# EAGLE design Enclosure 100x68 BPS (EAGLE 9.6.2)
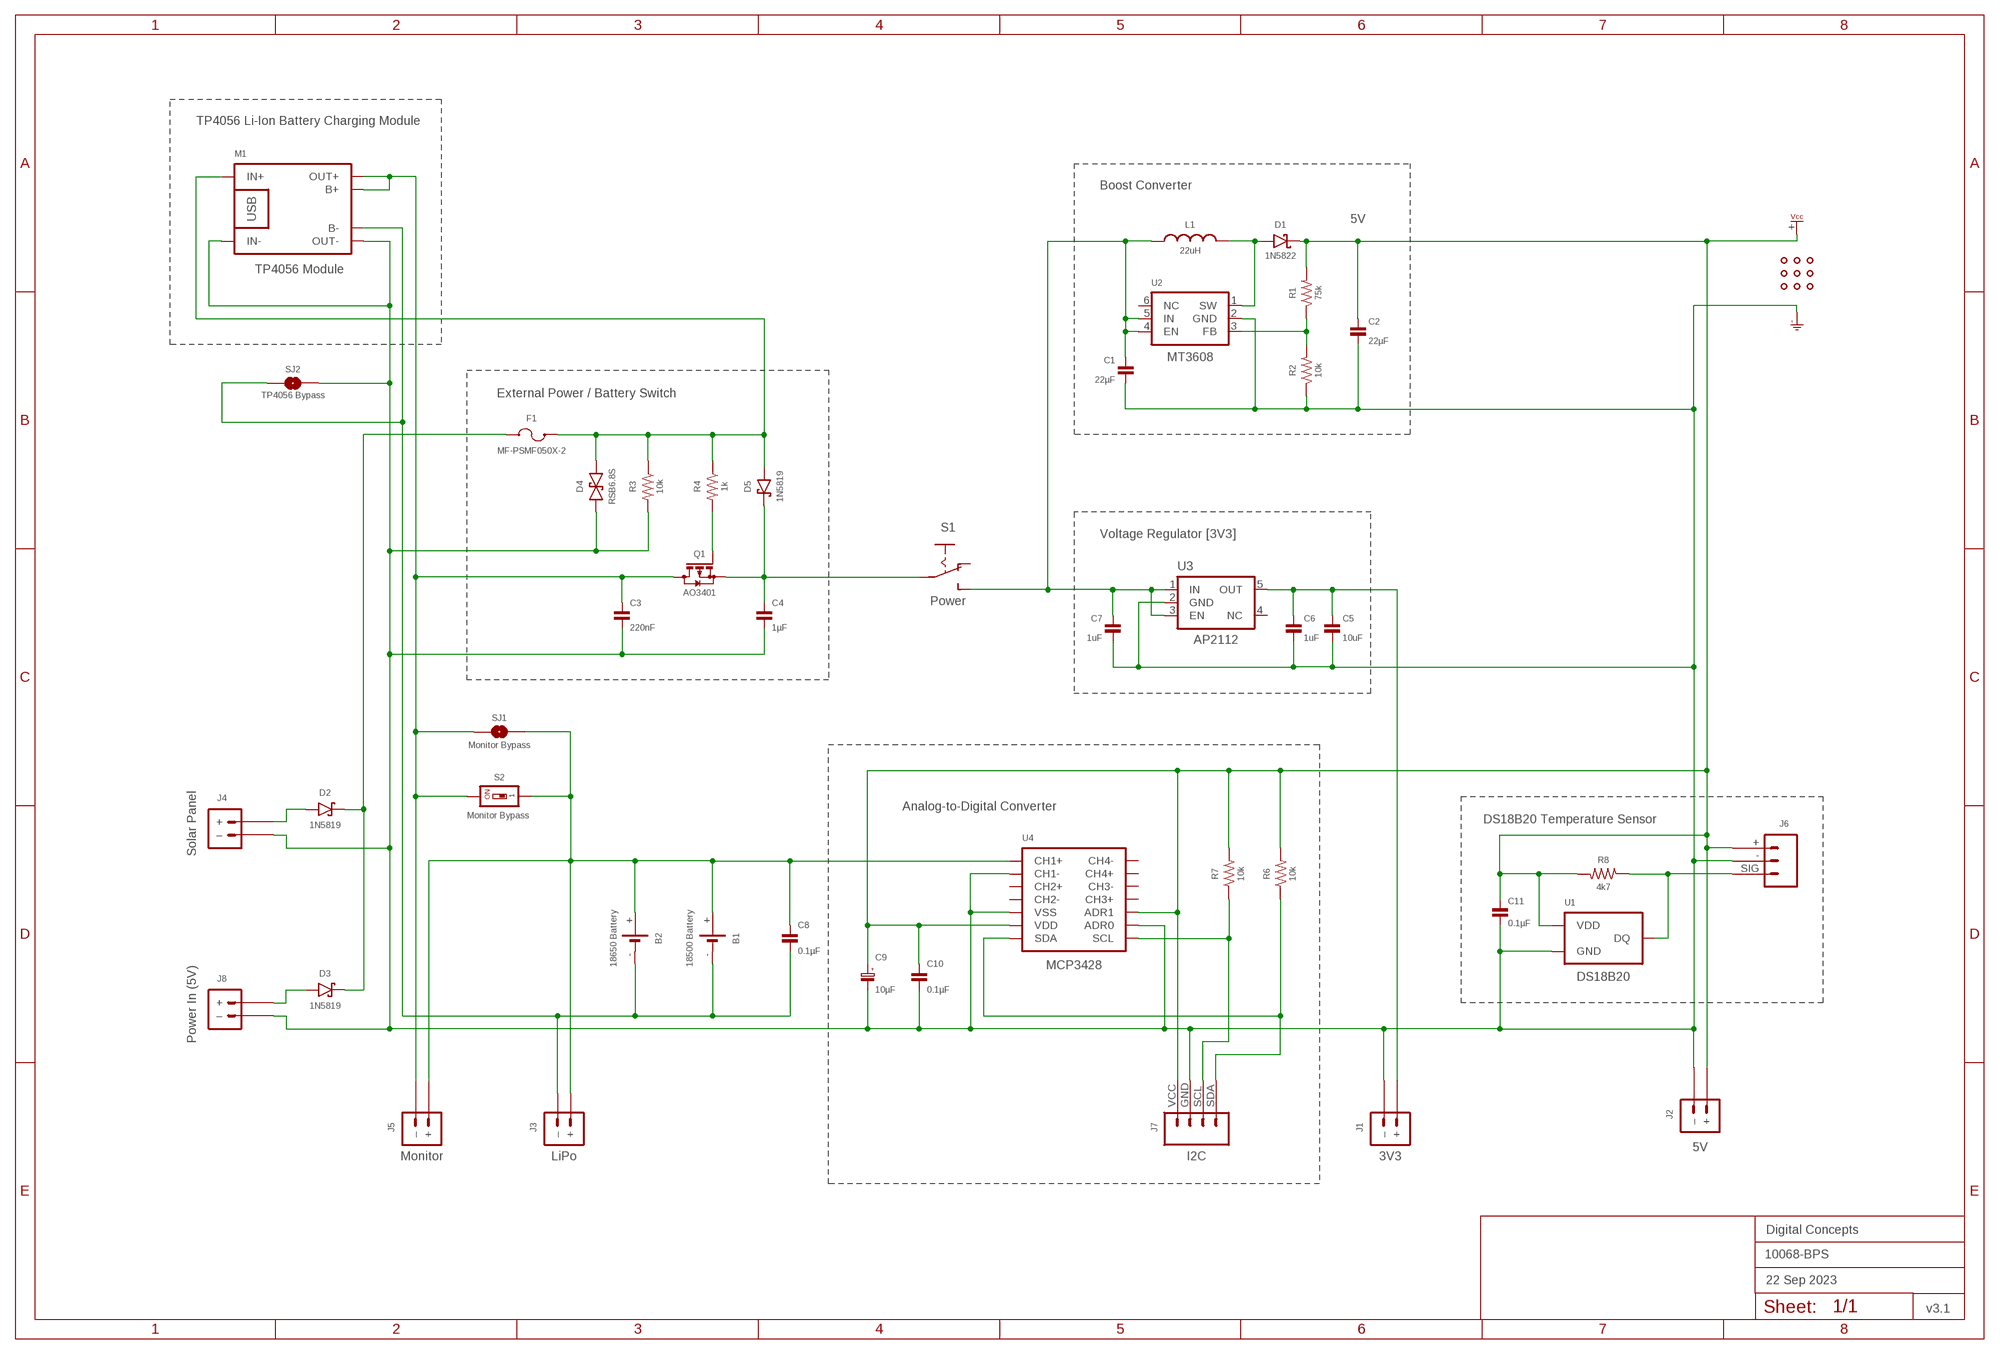
[diagram p0: schematic, sheet 1]
FRAME2 (A3L-LOC): DATE: 22 Sep 2023; OWNER: Digital Concepts; TITLE: 10068-BPS; VERSION: v3.1

## Parts
B1  18500 Battery  BATTERY-HOLDER-18500  [BATTERY-18500]
B2  18650 Battery  BATTERY-HOLDER-18650  [BATTERY-18650]
C1  22µF  CAPACITOR-1206  [C1206]
C2  22µF  CAPACITOR-1206  [C1206]
C3  220nF  CAPACITOR-0805  [C0805]
C4  1µF  CAPACITOR-0805  [C0805]
C5  10uF  CAPACITOR-0805  [C0805]
C6  1uF  CAPACITOR-0805  [C0805]
C7  1uF  CAPACITOR-0805  [C0805]
C8  0.1µF  CAPACITOR-0805  [C0805]
C9  10µF  CAPACITOR-1206-TANTALUM  [C1206-POLARISED]
C10  0.1µF  CAPACITOR-0805  [C0805]
C11  0.1µF  CAPACITOR-0805  [C0805]
D1  1N5822  DIODE-SCHOTTKY-1N5822  [DIODE_SMB]
D2  1N5819  DIODE-SCHOTTKY-1N5819  [SOD-123]
D3  1N5819  DIODE-SCHOTTKY-1N5819  [SOD-123]
D4  RSB6.8S  DIODE-BIDIRECTIONAL-RSB6.8S  [EMD2]
D5  1N5819  DIODE-SCHOTTKY-1N5819  [SOD-123]
F1  MF-PSMF050X-2  [F0805]
J1  3V3  JST-PH2.0-2-VERTICAL-POWER  [JST-PH2.0-2-VERTICAL-POWER]
J2  5V  JST-PH2.0-2-VERTICAL-POWER  [JST-PH2.0-2-VERTICAL-POWER]
J3  LiPo  JST-PH2.0-2-HORIZONTAL-POWERJST-PTH-2  [JST-PH2.0-2-HORIZONTAL-POWER]
J4  Solar Panel  JST-PH2.0-2-VERTICAL-POWER  [JST-PH2.0-2-VERTICAL-POWER]
J5  Monitor  JST-PH2.0-2-VERTICAL-POWER  [JST-PH2.0-2-VERTICAL-POWER]
J6  JST-PH2.0-3-HORIZONTAL-DS18B20  [JST-PH2.0-3-HORIZONTAL-DS18B20]
J7  I2C  JST-PH2.0-4-HORIZONTAL-I2C  [JST-PH2.0-4-HORIZONTAL-I2C]
J8  Power In (5V)  JST-GH1.25-2-HORIZONTAL-POWER  [JST-GH1.25-2-HORIZONTAL]
L1  22uH  INDUCTOR-CDRH104R+L5038P  [CDRH104R+]
M1  TP4056 Module  BATTERY-CHARGER-LI-PROT  [BATTERY-CHARGER-LI-PROT]
Q1  AO3401  MOSFET-AO3401  [SOT-23]
R1  75k  RESISTORR0805  [R0805]
R2  10k  RESISTORR0805  [R0805]
R3  10k  RESISTORR0805  [R0805]
R4  1k  RESISTORR0805  [R0805]
R6  10k  RESISTORR0805  [R0805]
R7  10k  RESISTORR0805  [R0805]
R8  4k7  RESISTORR0805  [R0805]
S1  Power  SWITCH-SLIDE-SPDT-PTH  [SWITCH-SPDT-PTH]
S2  Monitor Bypass  SWITCH-DIP-SWS001-VIA-1  [SMD-001-VIA-1]
SJ1  Monitor Bypass  SJ  [SJ]
SJ2  TP4056 Bypass  SJ  [SJ]
U1  DS18B20  THERMOMETER-DS18B20  [TO-92]
U2  MT3608  [SOT-23-6]
U3  AP2112  REGULATOR-AP2112  [SOT25]
U4  MCP3428  [SOIC-14]
U$1  PROTO-34X22-PI-CUT  [PROTO-34X22-PI-CUT]

## Nets
3V3: C5.1 C6.1 J1.+ U3.5(OUT)
5V: C2.1 C9.1(+) C10.1 C11.1 D1.C J2.+ J6.+ J7.VCC R1.2 R6.2 R7.2 R8.2 U1.3(VDD) U4.P$6(VDD) U4.P$10(ADR1) U$1.+(VCC)
GND: C1.2 C2.2 C3.2 C4.2 C5.2 C6.2 C7.2 C9.2(-) C10.2 C11.2 D4.P$2 J1.-(–) J2.-(–) J4.-(–) J6.- J7.GND J8.-(–) M1.IN- M1.OUT- R2.1 R3.2 SJ2.1 U1.1(GND) U2.2(GND) U3.2(GND) U4.P$2(CH1-) U4.P$5(VSS) U4.P$9(ADR0) U$1.-(GND)
N$1: D2.A J4.+
N$2: C1.1 C7.1 L1.2 S1.3(S) U2.4(EN) U2.5(IN) U3.1(IN) U3.3(EN)
N$4: R1.1 R2.2 U2.3(FB)
N$5: J7.SCL R7.1 U4.P$8(SCL)
N$6: D1.A L1.1 U2.1(SW)
N$7: D4.P$1 D5.A F1.2 M1.IN+ R3.1 R4.1
N$8: C4.1 D5.C Q1.2(S) S1.2(P)
N$10: B1.+ B2.+ C8.1 J3.+ J5.+ S2.1 S2.1@VIA SJ1.1 U4.P$1(CH1+)
N$11: D3.A J8.+
N$13: J6.SIG R8.1 U1.2(DQ)
N$15: J7.SDA R6.1 U4.P$7(SDA)
N$16: Q1.1(G) R4.2
N$17: C3.1 J5.-(–) M1.B+ M1.OUT+ Q1.3(D) S2.2 SJ1.2
N$38: B1.- B2.- C8.2 J3.-(–) M1.B- SJ2.2
N$41: D2.C D3.C F1.1
Unconnected: S1.1(O) U2.6(NC) U3.4(NC) U4.P$3(CH2+) U4.P$4(CH2-) U4.P$11(CH3+) U4.P$12(CH3-) U4.P$13(CH4+) U4.P$14(CH4-)

## Notes on the sheet
- TP4056 Li-Ion Battery Charging Module
- Boost Converter
- 5V
- External Power / Battery Switch
- Voltage Regulator [3V3]
- Analog-to-Digital Converter
- DS18B20 Temperature Sensor

## Library data of the parts
B1 = digitalconcepts:BATTERY-HOLDER-18500: 18500 Battery Holder
B2 = digitalconcepts:BATTERY-HOLDER-18650: 18650 Battery Holder
C1 C2 = digitalconcepts:CAPACITOR-1206: 1206 Capacitor
C3-C8 C10 C11 = digitalconcepts:CAPACITOR-0805: 0805 Capacitor
C9 = digitalconcepts:CAPACITOR-1206-TANTALUM: Capacitor 1206 Tantalum
D1 = digitalconcepts:DIODE-SCHOTTKY-1N5822: 1N5822 Schottky Diode SMB
D2 D3 D5 = digitalconcepts:DIODE-SCHOTTKY-1N5819: 1N5819 Schottky Diode SOD-123
D4 = digitalconcepts:DIODE-BIDIRECTIONAL-RSB6.8S: Schottky Bidirectional Diode
F1 = digitalconcepts:MF-PSMF050X-2: PTC Resettable Fuse 0.5A/6V 500mA SMD
J1 J2 J4 J5 = digitalconcepts:JST-PH2.0-2-VERTICAL-POWER: JST PH2.0 2P PTH Connector (Power)
J3 = digitalconcepts:JST-PH2.0-2-HORIZONTAL-POWER: PH2.0 2P Right Angle PCB Connector; PROD_ID: CONN-09863; SKU: PRT-09914
J6 = digitalconcepts:JST-PH2.0-3-HORIZONTAL-DS18B20: DS18B20 PH2.0 Right Angle PCB Connector
J7 = digitalconcepts:JST-PH2.0-4-HORIZONTAL-I2C: PH2.0 4P Horizontal I2C
J8 = digitalconcepts:JST-GH1.25-2-HORIZONTAL-POWER: JST GH1.25 2P PTH Connector (Power)
L1 = digitalconcepts:INDUCTOR-CDRH104R+: Inductor SMD CDRH104R, with extended pads (for easier hand soldering); SPICEPREFIX: L
M1 = digitalconcepts:BATTERY-CHARGER-LI-PROT: TP4056 Li Battery Charger module with PCB (rather than module) footprint
Q1 = digitalconcepts:MOSFET-AO3401: AO3401 P-Channel MOSFET
R1-R4 R6-R8 = digitalconcepts:RESISTOR: Resistor; SPICEPREFIX: R
S1 = digitalconcepts:SWITCH-SLIDE-SPDT-PTH: Mini Sliding Switch SPDT PTH
S2 = digitalconcepts:SWITCH-DIP-SWS001-VIA-1: SMD Dip Switch 1 pol.
SJ1 SJ2 = digitalconcepts:SJ: Solder Jumper
U1 = digitalconcepts:THERMOMETER-DS18B20: Digital Thermometer -55C-125C TO92-3; AVAILABILITY: Bad; DESCRIPTION: Temperature Sensor Digital, Local -55°C ~ 125°C 12 b 8-uMAX; MF: Maxim Integrated; MP: DS18B20; PACKAGE: TO-92 Maxim Integrated; PRICE: None
U2 = digitalconcepts:MT3608: MT3608 DC-DC Step-Up Voltage Converter
U3 = digitalconcepts:REGULATOR-AP2112: Diodes Incorporated LDO Regulator with Enable; OC_FARNELL: unknown; OC_NEWARK: unknown
U4 = digitalconcepts:MCP3428: MCP3428 4 Channel ADC
U$1 = digitalconcepts:PROTO-34X22-PI-CUT: 34 x 22 Prototyping board, with Raspberyr Pi Zero mount points and power supply socket cut-out, to fit an 100 x 68 enclosure

## Board
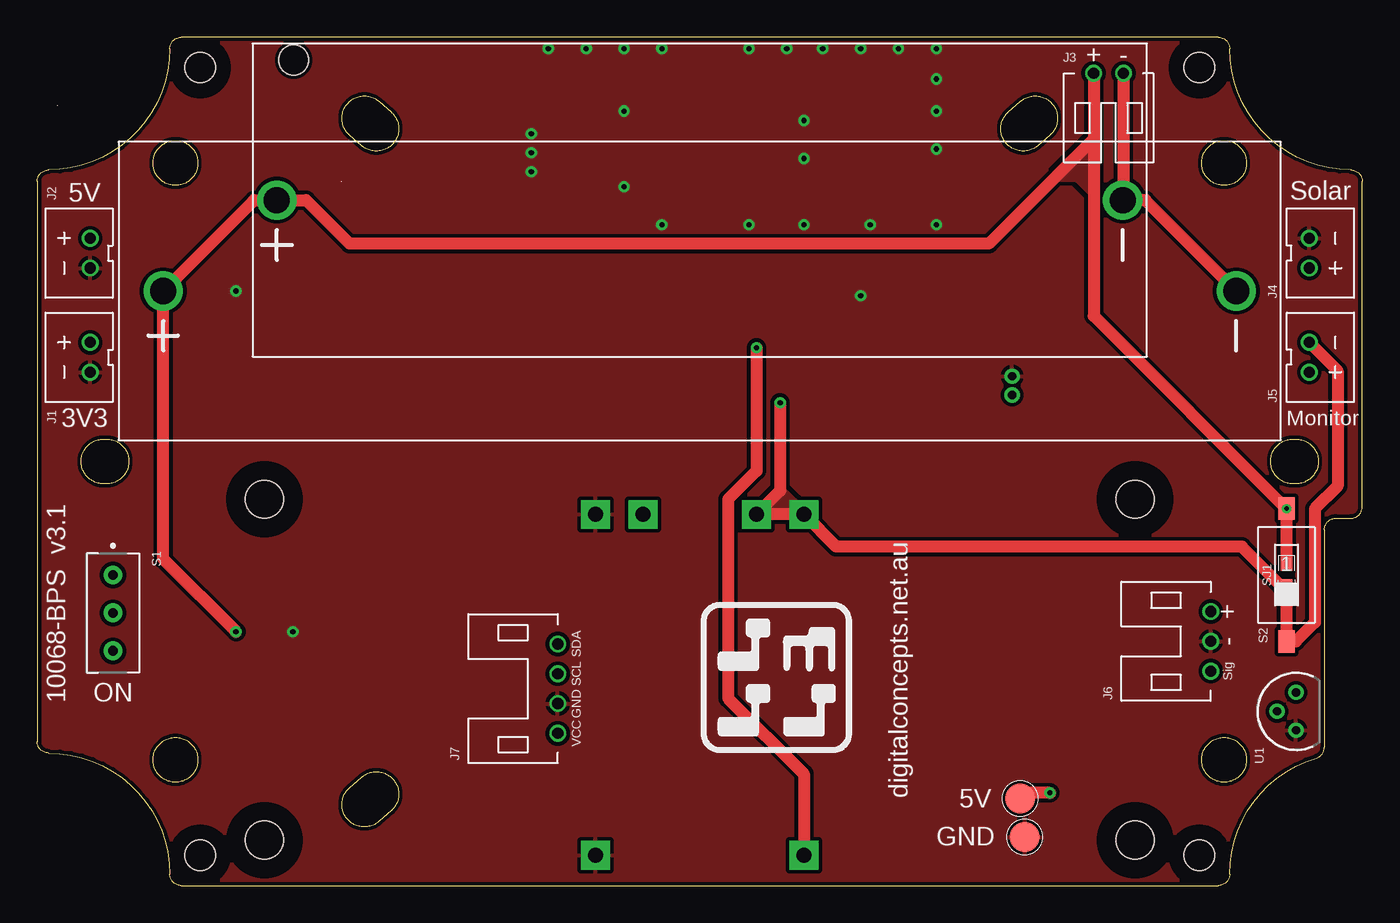
[diagram p1: board, top side]
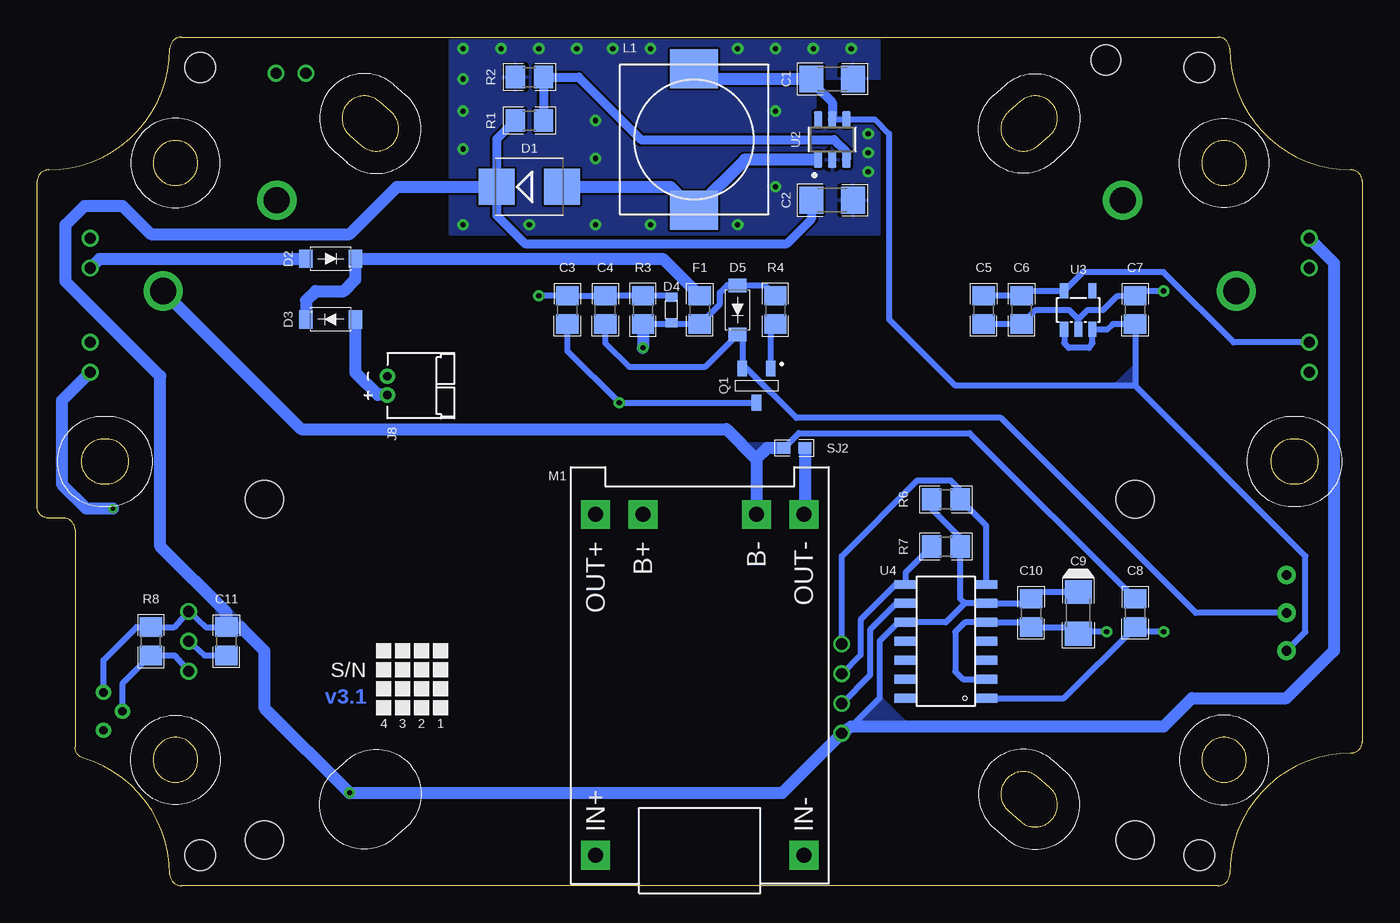
[diagram p2: board, bottom side, seen from below]

Size 88.9 x 56.9 mm. Coordinates in mm from the lower left corner, seen from the top.
Copper layers (1*16): Top 0.035mm / dielectric 1.5mm / Bottom 0.035mm
Design rules "default *": minimum track width 6mil, minimum drill 0.3mm, track to track 6mil, track to pad 6mil, pad to pad 6mil, via to via 6mil, smd to smd 6mil, copper to edge 6mil, drill to drill 6mil, minimum pad ring 1mil, minimum via ring 8mil, stop-mask expansion 4mil, vias tented up to drill 0mil, thermal gap 10mil

### Footprints (pad centres in the part's own frame; a part is rotated, then mirrored left to right if it is on the bottom)
BATTERY-18500 = drill 1.75: + -28.375,0; - 28.375,0 | hole 2: -27.25,9.4
BATTERY-18650 = drill 1.75: + -36,0; - 36,0
C1206 = smd 1.6 x 1.8: 1 -1.4,0; 2 1.4,0
C0805 = smd 1.3 x 1.5: 1 -0.95,0; 2 0.95,0
C1206-POLARISED = smd 1.6 x 1.8: 1 -1.4,0; 2 1.4,0
DIODE_SMB = smd 2.4 x 2.4: A 2.2,0; C -2.2,0
SOD-123 = smd 0.91 x 1.22: A -1.65,0; C 1.65,0
EMD2 = smd 0.6 x 0.8: P$1 -0.85,0; P$2 0.85,0
F0805 = smd 1.3 x 1.5: 1 -0.95,0; 2 0.95,0
JST-PH2.0-2-VERTICAL-POWER = drill 0.75: + -1,0; - 1,0
JST-PH2.0-2-HORIZONTAL-POWER = drill 0.75: + 1,0; - -1,0
JST-PH2.0-3-HORIZONTAL-DS18B20 = drill 0.75: + 2,0; - 0,0; SIG -2,0
JST-PH2.0-4-HORIZONTAL-I2C = drill 0.75: GND -1,0; SCL 1,0; SDA 3,0; VCC -3,0
JST-GH1.25-2-HORIZONTAL = drill 0.55 pad 1.016: + -0.625,0; - 0.625,0
CDRH104R+ = smd 2.6 x 3.2: 1 -4.75,0; 2 4.75,0
BATTERY-CHARGER-LI-PROT = drill 1 pad 1.93 square: B+ 10.795,3.81; B- 10.795,-3.81; IN+ -12.065,6.985; IN- -12.065,-6.985; OUT+ 10.795,6.985; OUT- 10.795,-6.985
SOT-23 = smd 0.65 x 1.05: 1 -0.95,-1.15; 2 0.95,-1.15; 3 0,1.15
R0805 = smd 1.3 x 1.5: 1 -0.95,0; 2 0.95,0
SWITCH-SPDT-PTH = drill 0.65 pad 1.27: 1 -2.54,0; 2 0,0; 3 2.54,0
SMD-001-VIA-1 = smd 1.1 x 1.5: 1 0,-4.45; 2 0,4.45 | drill 0.3 pad 0.61: 1@VIA 0,-4.45
SJ = smd 0.864 x 0.762: 1 -0.711,0; 2 0.711,0
TO-92 = drill 0.55 pad 1.016: 1 -1.27,0; 2 0,1.27; 3 1.27,0
SOT-23-6 = smd 1.1 x 0.6: 1 -1.35,0.95; 2 -1.35,0; 3 -1.35,-0.95; 4 1.35,-0.95; 5 1.35,0; 6 1.35,0.95
SOT25 = smd 0.55 x 1: 1 -0.95,-1.3; 2 0,-1.3; 3 0.95,-1.3; 4 0.95,1.3; 5 -0.95,1.3
SOIC-14 = smd 0.6 x 1.5: P$1 -3.815,-2.7; P$2 -2.54,-2.7; P$3 -1.27,-2.7; P$4 0,-2.7; P$5 1.27,-2.7; P$6 2.54,-2.7; P$7 3.81,-2.7; P$8 3.81,2.7; P$9 2.54,2.7; P$10 1.27,2.7; P$11 0,2.7; P$12 -1.27,2.7; P$13 -2.54,2.7; P$14 -3.81,2.7
PROTO-34X22-PI-CUT = smd 2 x 2: + 21.51,-22.6; - 21.81,-25.2 | hole 2.032: -33.528,26.416; 33.528,26.416; 33.528,-26.416; -33.528,-26.416 | hole 2.54: -29.21,-25.4; 29.21,-25.4; -29.21,-2.54; 29.21,-2.54

### Placement (x,y rotation side)
B1  44.45,45.97 0 top
B2  44.45,39.88 0 top
C1  35.56,54.1 0 bottom
C2  35.56,45.97 0 bottom
C3  53.34,38.61 90 bottom
C4  50.8,38.61 90 bottom
C5  25.4,38.61 270 bottom
C6  22.86,38.61 270 bottom
C7  15.24,38.61 90 bottom
C8  15.24,18.29 90 bottom
C9  19.05,18.29 270 bottom
C10  22.23,18.29 270 bottom
C11  76.2,16.38 270 bottom
D1  55.88,46.86 0 bottom
D2  69.22,42.04 0 bottom
D3  69.22,37.97 180 bottom
D4  46.36,38.61 90 bottom
D5  41.91,38.61 270 bottom
F1  44.45,38.61 270 bottom
J1  3.56,35.43 270 top
J2  3.56,42.42 270 top
J3  71.88,54.48 180 top
J4  85.34,42.42 90 top
J5  85.34,35.43 90 top
J6  78.74,16.38 90 top
J7  34.93,13.21 90 top
J8  65.41,33.53 90 bottom
L1  44.83,50.04 90 bottom
M1  44.45,14.1 90 bottom
Q1  40.64,33.53 180 bottom
R1  55.88,51.31 180 bottom
R2  55.88,54.23 0 bottom
R3  48.26,38.61 90 bottom
R4  39.37,38.61 270 bottom
R6  27.94,25.91 180 bottom
R7  27.94,22.73 0 bottom
R8  81.28,16.38 90 bottom
S1  5.08,18.29 270 top
S2  83.82,20.83 180 top
SJ1  83.82,20.83 270 top
SJ2  38.1,29.34 180 bottom
U1  84.45,11.68 90 top
U2  35.56,50.04 90 bottom
U3  19.05,38.61 0 bottom
U4  27.94,16.38 90 bottom
U$1  44.45,28.45 0 top

### Tracks (layer width: path | path; a pad name or v marks a point on that pad's centre or on a via)
3V3
  Bottom 0.406: C5.1 C6.1 22.51,39.91 U3.5 18.76,41.15 13.34,41.15 8.62,36.43 J1.+
5V  (via drill 0.35)
  Top 0.813: U$1.+ 66.34,6.22 v67.95,6.22
  Bottom 0.406: U1.3 84.45,15.11 82.23,17.33 R8.2 79.7,17.33 J6.+ 77.59,17.33 C11.1 | C9.1 21.78,19.69 C10.1 22.54,18.92 U4.P$6 26.67,18.92 | 26.67,18.92 27.94,17.65 U4.P$10 31.12,17.65 32.39,16.38 32.39,12.57 34.29,10.67 | R6.2 28.89,25.27 26.99,23.37 R7.2 26.99,19.24 26.67,18.92
  Bottom 0.61: C2.1 36.96,44.7 38.61,43.05 56.18,43.05 58.08,44.96 D1.C 58.08,50.06 R1.2
  Bottom 0.813: J2.+ 1.91,41.77 1.91,15.75 5.08,12.57 11.43,12.57 13.34,10.67 34.29,10.67 J7.VCC 38.91,6.22 v67.95,6.22 73.66,11.94 73.66,15.75 75.25,17.33 C11.1 76.2,18.29 80.64,22.73 80.64,34.16 87,40.51 87,44.32 85.73,45.59 83.19,45.59 81.28,43.69 67.95,43.69 64.77,46.86 D1.C
  pour Bottom (no thermals): 32.39,12.57 30.48,10.67 34.29,10.67
  pour Bottom (no thermals): 76.54,18.63 75.01,17.09 76.54,17.09
$X0
  cutout Bottom: 10.92,56.9 arc180 10.92,52.83 arc180
$X1
  cutout Bottom: 77.98,56.9 arc180 77.98,52.83 arc180
$X2
  cutout Bottom: 77.98,4.06 arc180 77.98,0 arc180
$X3
  cutout Bottom: 10.92,4.06 arc180 10.92,0 arc180
$X4
  cutout Top: 10.92,56.9 arc180 10.92,52.83 arc180
$X5
  cutout Top: 77.98,56.9 arc180 77.98,52.83 arc180
$X6
  cutout Top: 77.98,4.06 arc180 77.98,0 arc180
$X7
  cutout Top: 10.92,4.06 arc180 10.92,0 arc180
GND  (via drill 0.35)
  Bottom 0.406: D4.P$2 46.45,39.56 R3.2 C4.2 C3.2 v55.25,39.56 | C5.2 C6.2 21.91,38.61 19.69,38.61 19.05,37.97 | 19.05,37.97 18.42,38.61 17.38,38.61 16.43,39.56 C7.2 14.92,39.88 v13.34,39.88 | U3.2 19.05,37.97 | U4.P$2 26.79,13.84 27.3,14.36 27.3,17.02 26.67,17.65 U4.P$5 22.54,17.65 C10.2 19.5,17.34 19.12,16.95 | 19.12,16.95 C9.2 | U4.P$9 31.24,18.92 33.02,17.15 33.02,14.11 J7.GND | v17.15,17.02 19.05,17.02 19.12,16.95 | J6.- 77.7,15.43 C11.2
  Bottom 0.813: SJ2.1 37.39,24.97 M1.OUT-
  other vias: 33.15,50.42 33.15,49.15 33.15,47.88 39.37,51.94 47.75,44.32 39.37,56.13 51.44,48.77 41.91,56.13 50.29,56.13 39.37,46.86 41.91,44.32 47.75,56.13 52.7,56.13 55.25,56.13 57.79,56.13 36.83,56.13 34.29,56.13 60.33,56.13 51.44,51.31 60.33,54.1 60.33,49.4 60.33,51.94 51.44,44.32 60.33,44.32 55.88,44.32
  pour Top (isolate 0.254, rank 5): -2.97,59.46 -2.97,-2.6 91.81,-2.6 91.81,59.46
  pour Bottom (rank 2): 61.21,57.02 32.39,57.02 32.39,54.13 36.7,54.13 36.7,51.18 32.39,51.18 32.39,43.69 61.21,43.69
N$1
  Bottom 0.813: J4.+ 84.73,42.04 D2.A
N$2
  Bottom 0.406: U3.1 20,36.38 19.69,36.07 18.34,36.07 18.1,36.38 U3.3 17.11,37.3 16.75,37.66 C7.1 15.24,33.53 | U2.5 U2.4 32.7,51.39 31.75,50.43 31.75,37.97 27.3,33.53 15.24,33.53 | S1.3 3.81,17.02 3.81,22.1 15.24,33.53
  Bottom 0.61: C1.1 36.51,53.48 35.56,52.53 U2.5
  Bottom 0.813: L1.2 44.15,54.1 C1.1
  pour Bottom (no thermals): 15.24,33.53 15.24,34.8 16.51,33.53
N$4
  Bottom 0.61: U2.3 34.61,49.22 35.43,50.04 48.39,50.04 52.58,54.23 R2.2 R1.1
N$5
  Bottom 0.406: R7.1 30.64,20.98 U4.P$8 31.27,20.19 33.66,17.81 33.66,15.48 J7.SCL
N$6
  Bottom 0.152: U2.1 36.7,48.69
  Bottom 0.813: D1.A 46.41,46.86 L1.1 41.43,48.69 36.7,48.69
N$7  (via drill 0.35)
  Top 0.813: v48.26,36.07 48.26,27.81 46.36,25.91 46.36,12.57 51.44,7.49 M1.IN+
  Bottom 0.406: R3.1 46.45,37.66 D4.P$1 46.26,37.66 F1.2 43.1,39 43.1,39.77 42.6,40.27 D5.A 40.07,40.26 R4.1
  Bottom 0.813: R3.1 v48.26,36.07
N$8
  Bottom 0.406: C4.1 50.8,36.39 49.21,34.8 44.07,34.8 D5.C 41.59,36.64 Q1.2 41.28,34.68 37.97,31.37 24.26,31.37 11.18,18.29 S1.2
N$10  (via drill 0.35)
  Top 0.813: SJ1.1 S2.1@VIA 70.88,38.22 70.88,50.1 | J3.+ 70.88,50.1 | 70.88,50.1 63.84,43.05 20.96,43.05 18.03,45.97 B1.+ 14.55,45.97 B2.+ 8.45,21.9 v13.34,17.02
  Bottom 0.406: U4.P$1 20.01,12.57 C8.1 14.92,17.02 v13.34,17.02
  Bottom 0.813: S2.1@VIA 85.6,25.28 87.25,26.93 87.25,32.53 J5.+
  pour Top (no thermals): 70.88,46.51 69.83,47.56 68.34,47.56 70.88,50.1
N$11
  Bottom 0.813: D3.A 67.56,34.43 66.04,32.9 J8.+
N$13
  Bottom 0.406: U1.2 83.19,13.53 R8.1 79.7,15.43 J6.SIG
N$15
  Bottom 0.406: U4.P$7 25.24,24.16 R6.1 26.99,26.54 27.62,27.18 29.84,27.18 34.93,22.1 J7.SDA
N$16
  Bottom 0.406: R4.2 39.69,37.34 Q1.1
N$17  (via drill 0.35)
  Top 0.813: J5.- 87.25,34.53 87.25,26.8 85.73,25.27 85.73,17.65 84.45,16.38 S2.2 SJ1.2 83.44,20.12 80.82,22.73 53.59,22.73 M1.OUT+ M1.B+ 49.85,26.48 v49.85,32.38
  Bottom 0.406: Q1.3 v49.85,32.38 53.34,35.87 C3.1
  pour Top (no thermals): 48.26,24.89 49.85,26.48 51.44,24.89
N$38
  Top 0.813: B2.- 74.35,45.97 B1.- 72.88,46.03 J3.-
  Bottom 0.406: SJ2.2 37.8,30.35 26.36,30.35 C8.2
  Bottom 0.813: B2.- 71.18,30.61 42.67,30.61 40.64,28.58 | SJ2.2 39.95,29.34 40.64,28.65 40.64,28.58 | 40.64,28.58 M1.B-
  pour Bottom: 39.95,29.34 41.33,29.34 40.64,28.7
N$41
  Bottom 0.813: D3.C 70.86,39.24 70.23,39.88 68.33,39.88 67.56,40.64 D2.C 46.93,42.04 F1.1

### Text on the board
Bottom: v3.1
tPlace: 10068-BPS v3.1 | digitalconcepts.net.au
bPlace: S/N | 1 | 2 | 3 | 4
tNames: Solar | ON | 5V | GND
tValues: Monitor Bypass